# Altium schematic sheet LDO_Schematic.SchDoc: Exercise 4
size A4; DrawnBy: Amal & Carles; DocumentNumber: 1; Revision: 1; SheetNumber: 1; SheetTotal: 1; SheetOf: LDO Voltage Regulator (3V3, 1V8)
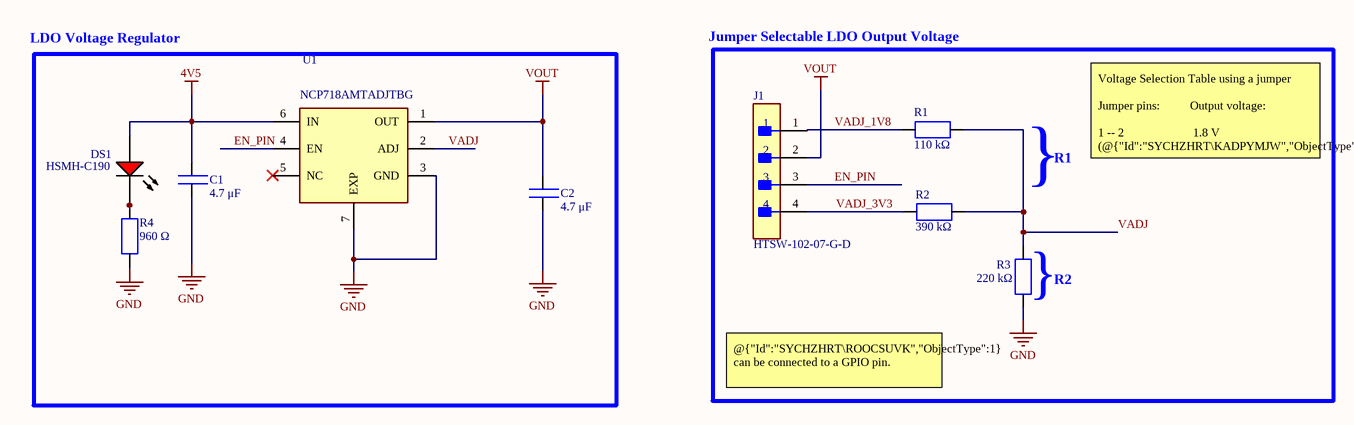
[diagram p0: LDO_Schematic.SchDoc]

## Parts
C1  4.7 μF  [CAP_0201]
C2  4.7 μF  [CAP_0201]
DS1  HSMH-C190  [HSMH-C190]
J1  HTSW-102-07-G-D  [FP-HTSW-102-07-G-D-MFG]
R1  110 kΩ  [RES_0201]
R2  390 kΩ  [RES_0201]
R3  220 kΩ  [RES_0201]
R4  960 Ω  [RES_0201]
U1  NCP718AMTADJTBG  [NCP718AMTADJTBG]

## Blocks framed on the sheet
LDO Voltage Regulator: C1 C2 DS1 R4 U1
}: J1 R1-R3

## Nets
4V5: C1.2 DS1.1(A) U1.6(IN)
GND: C1.1 C2.1 R3.2 R4.2 U1.3(GND) U1.7(EXP)
VOUT: C2.2 J1.2 U1.1(OUT)
EN_PIN: J1.3 U1.4(EN)
VADJ: R1.1 R2.1 R3.1 U1.2(ADJ)
VADJ_1V8: J1.1 R1.2
VADJ_3V3: J1.4 R2.2
NetDS1_2: DS1.2(K) R4.1

Not connected (* = marked no-connect by the designer): U1 5(NC)*

## Notes on the sheet
- Jumper Selectable LDO Output Voltage
- R1
- Voltage Selection Table using a jumper
  Jumper pins:          Output voltage:
  1 -- 2                       1.8 V (@{"Id":"SYCHZHRT\KADPYMJW","ObjectType":1})
  2 -- 3                       3.3 V (@{"Id":"SYCHZHRT\OBUEEYJK","ObjectType":1})
- (near R3) }
- (near R3) R2
- @{"Id":"SYCHZHRT\ROOCSUVK","ObjectType":1}  can be connected to a GPIO pin.

## Library data of the parts
C1 = CAP_0201: Capacitor SMD 0201 Generic; Manufacturer: YAGEO; Manufacturer Part Number: CC0201KRX7R7BB103; Capacitance: 10 nF; Tolerance: 10%; LCSC Part Number: C272853
C2 = CAP_0201: Capacitor SMD 0201 Generic; Manufacturer: YAGEO; Manufacturer Part Number: CC0201KRX7R7BB103; Tolerance: 10%; LCSC Part Number: C272853; Capacitance: 4.7 μF
DS1 = HSMH-C190: LED Uni-Color Red, 65 mW, 20 mA, -40 to 85 degC, 2-Pin SMD, RoHS, Tape and Reel; Connector Type: USB; Gender: Male; Current Rating: 1 A; Length: 7.5 mm; Lead Pitch: 0.65 mm; PackageReference: HSMX-C190; Package Quantity: 2000; Max Operating Temperature: 85 degC; PackageDescription: 2-Pin Surface Mount Device, Body 1.6 x 0.8 mm, Height 0.9 mm; ComponentLink3Description: Package Specification; Mount: Surface Mount; Min Operating Temperature: -30 degC; ComponentLink3URL: http://www.fairchildsemi.com/dwg/MA/MA03D.pdf; ComponentLink1Description: Manufacturer URL; Contact Material: Copper; Pins: 5; Width: 5.6 mm; ComponentLink2Description: Datasheet; RoHSCompliant: true; DatasheetVersion: Mar-12; Height: 2.8 mm; Packaging: Tape and Reel; Contact Plating: Gold; ComponentLink1URL: http://www.avagotech.com/; REACH SVHC: No SVHC; ComponentLink2URL: http://docs.avagotech.com/docs/AV02-0551EN
J1 = CMP-02766-000010-1: CONN HEADER VERT 4POS 2.54MM; Manufacturer: Samtec; Voltage Rating: 550V; Conn Orientation: Straight; Number Of Contacts: 4; Conn Gender: Male; Current Rating: 6.3A; Number Of Rows: 2; Category: Conn; Temperature: -55°C to +125°C; Automotive: No; Digikey Description: CONN HEADER VERT 4POS 2.54MM; ComponentLink2URL: http://suddendocs.samtec.com/catalog_english/htsw_th.pdf; Device Class L2: Headers and Wire Housings; Mouser Description: Conn Unshrouded Header HDR 4 POS 2.54mm Solder ST Thru-Hole Bag; Manufacturer Part Number: HTSW-102-07-G-D; Temperature Range High: +125°C; Contact Material: Gold,Nickel; Temperature Range Low: -55°C; ComponentLink2Description: Datasheet; Device Class L1: Connectors; Pitch: 2.54mm; Octopart: https://octopart.com/htsw-102-07-g-d-samtec-10531767; RoHS: TRUE; Package: HTSW-102-07-G-D; Lead Free: Yes; Device Class L3: unset; Height: 8.71mm
R1 = RES_0201: Resistor SMD 0201; Manufacturer: YAGEO; Manufacturer Part Number: RT0201BRD07200RL; Tolerance: 0.1%; Resistance: 110 kOhm; LCSC Part Number: C852221
R2 = RES_0201: Resistor SMD 0201 Generic; Manufacturer: YAGEO; Manufacturer Part Number: RT0201BRD07200RL; Tolerance: 0.1%; Resistance: 390 kOhm; LCSC Part Number: C852221
R3 = RES_0201: Resistor SMD 0201 Generic; Manufacturer: YAGEO; Manufacturer Part Number: RT0201BRD07200RL; Tolerance: 0.1%; Resistance: 220 kOhm; LCSC Part Number: C852221
R4 = RES_0201: Resistor SMD 0201 Generic; Manufacturer: YAGEO; Manufacturer Part Number: RT0201BRD07200RL; Tolerance: 0.1%; Resistance: 200 Ohm; LCSC Part Number: C852221
U1 = NCP718AMTADJTBG: NCP718AMTADJTBG LDO Regulator, 300 mA, Wide Vin, Ultra-Low Iq Adjustable, Active Discharge, WDFN6; NexarPartId: 87159789; Output Current: 300mA; Number of Outputs: 1; Max Supply Voltage: 24V; Dropout Voltage: 490mV; Nominal Supply Current: 4µA; Min Supply Voltage: 2.5V; Max Junction Temperature (Tj): 150°C; Accuracy: 2%; Max Operating Temperature: 150°C; Output Type: Adjustable; Height: 800µm; RoHS: Compliant; Manufacturer Lifecycle Status: ACTIVE; Number of Channels: 1; Schedule B: 8542390000, 8542390000|8542390000|8542390000|8542390000|8542390000; Lifecycle Status: Production